# EAGLE design M206 (EAGLE 6.6.0)
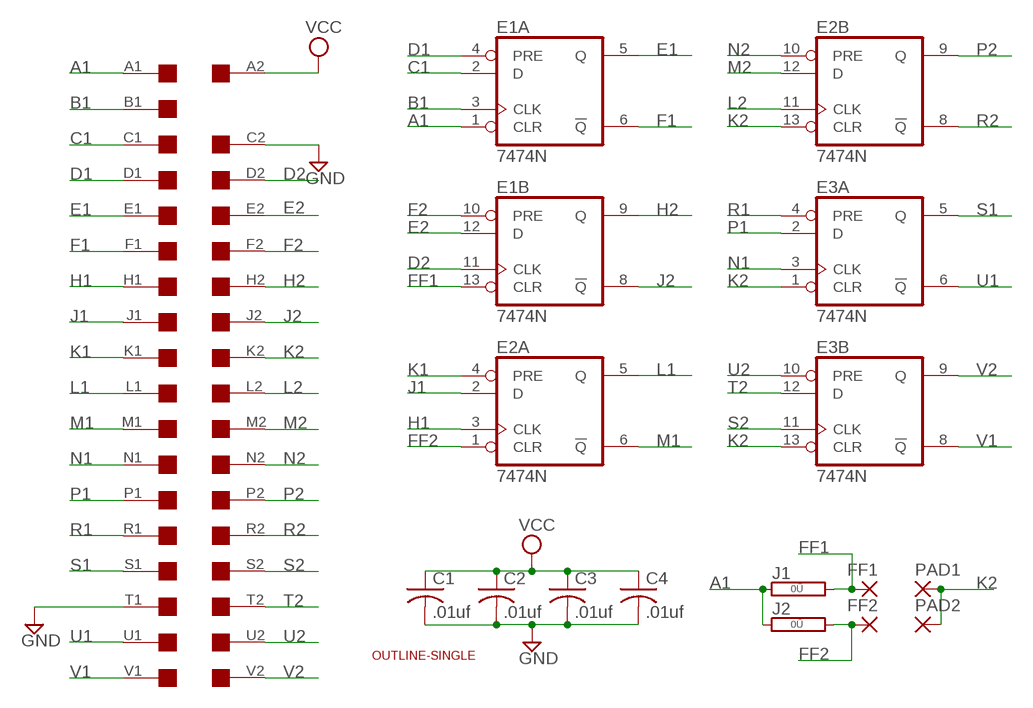
[diagram p0: schematic, sheet 1]

## Parts
C1  .01uf  C-US050-025X075  [C050-025X075]
C2  .01uf  C-US050-025X075  [C050-025X075]
C3  .01uf  C-US050-025X075  [C050-025X075]
C4  .01uf  C-US050-025X075  [C050-025X075]
E1  7474N  74S74N  [DIL14]
E2  7474N  74S74N  [DIL14]
E3  7474N  74S74N  [DIL14]
FF1  1,6/0,8  [1,6/0,8]
FF2  1,6/0,8  [1,6/0,8]
J1  0R  [0R/10]
J2  0R  [0R/10]
PAD1  1,6/0,8  [1,6/0,8]
PAD2  1,6/0,8  [1,6/0,8]
U$1  OUTLINE-SINGLE  [SINGLE]
U$4  SINGLE  [EDGE-CON2]

## Nets
A1: E1.1(A:CLR) J1.1 J2.1 U$4.A1
B1: E1.3(A:CLK) U$4.B1
C1: E1.2(A:D) U$4.C1
D1: E1.4(A:PRE) U$4.D1
D2: E1.11(B:CLK) U$4.D2
E1: E1.5(A:Q) U$4.E1
E2: E1.12(B:D) U$4.E2
F1: E1.6(A:!Q) U$4.F1
F2: E1.10(B:PRE) U$4.F2
FF1: E1.13(B:CLR) FF1.1(P) J1.2
FF2: E2.1(A:CLR) FF2.1(P) J2.2
GND: C1.2 C2.2 C3.2 C4.2 U$4.C2 U$4.T1
H1: E2.3(A:CLK) U$4.H1
H2: E1.9(B:Q) U$4.H2
J1: E2.2(A:D) U$4.J1
J2: E1.8(B:!Q) U$4.J2
K1: E2.4(A:PRE) U$4.K1
K2: E2.13(B:CLR) E3.1(A:CLR) E3.13(B:CLR) PAD1.1(P) PAD2.1(P) U$4.K2
L1: E2.5(A:Q) U$4.L1
L2: E2.11(B:CLK) U$4.L2
M1: E2.6(A:!Q) U$4.M1
M2: E2.12(B:D) U$4.M2
N1: E3.3(A:CLK) U$4.N1
N2: E2.10(B:PRE) U$4.N2
P1: E3.2(A:D) U$4.P1
P2: E2.9(B:Q) U$4.P2
R1: E3.4(A:PRE) U$4.R1
R2: E2.8(B:!Q) U$4.R2
S1: E3.5(A:Q) U$4.S1
S2: E3.11(B:CLK) U$4.S2
T2: E3.12(B:D) U$4.T2
U1: E3.6(A:!Q) U$4.U1
U2: E3.10(B:PRE) U$4.U2
V1: E3.8(B:!Q) U$4.V1
V2: E3.9(B:Q) U$4.V2
VCC: C1.1 C2.1 C3.1 C4.1 U$4.A2
Unconnected: U$4.B2

## Power pins joined to a net without a drawn wire
GND: E1.7(P:GND) E2.7(P:GND) E3.7(P:GND)
VCC: E1.14(P:VCC) E2.14(P:VCC) E3.14(P:VCC)

## Library data of the parts
C1-C4 = rcl:C-US: CAPACITOR, American symbol
E1-E3 = 74xx-us:74*74: Dual D type positive edge triggered FLIP FLOP, preset and clear
FF1 FF2 PAD1 PAD2 = wirepad:1,6/0,8: THROUGH-HOLE PAD
J1 J2 = jumper:0R: Bridge 0R 10mm
U$1 = dec-con:OUTLINE-*: Board outlines for DEC boards.
U$4 = dec-con:SINGLE: Single-Height DEC board

## Board
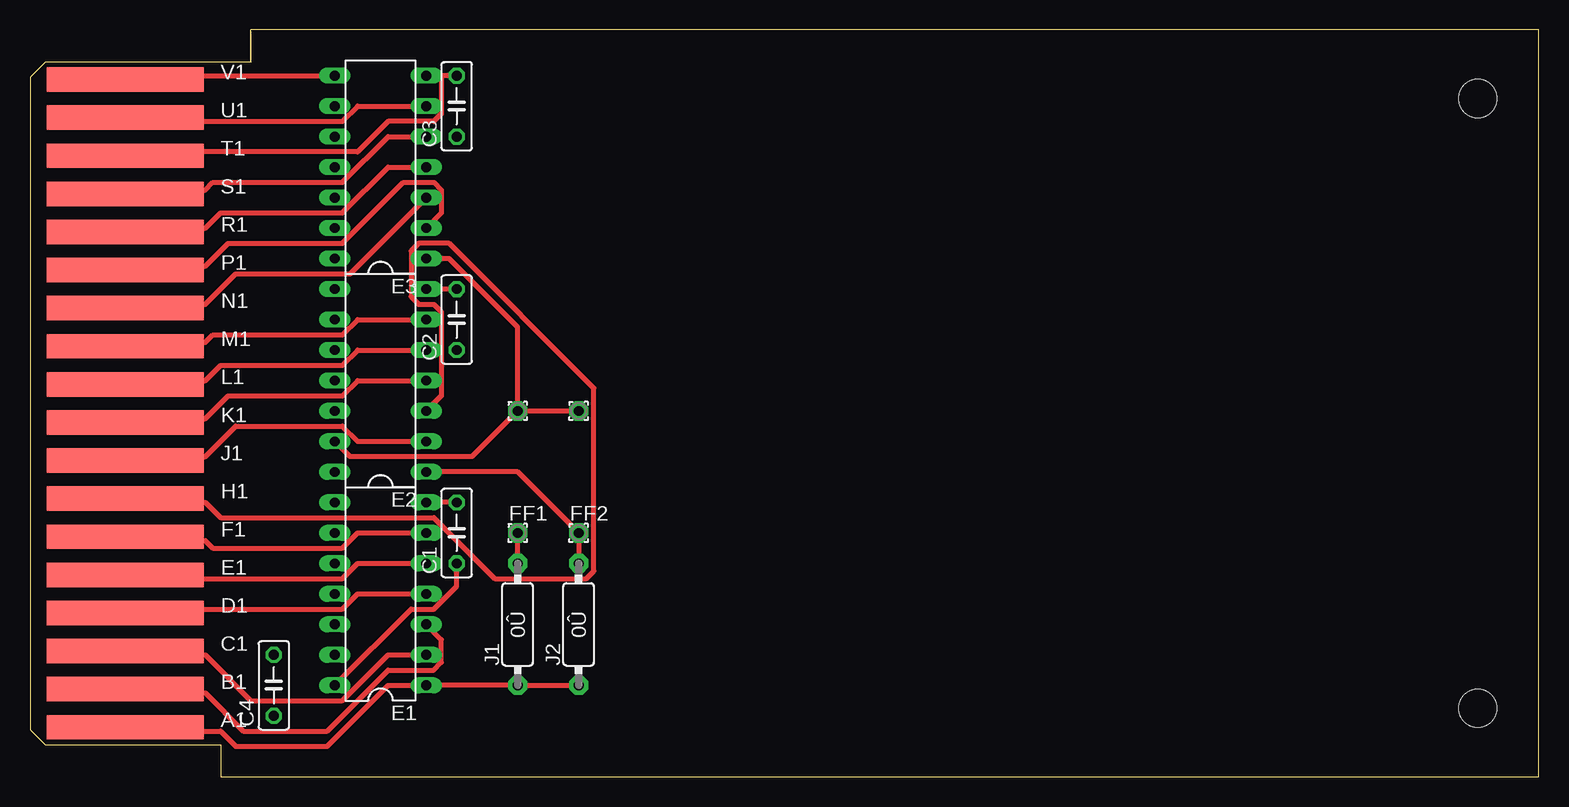
[diagram p1: board, top side]
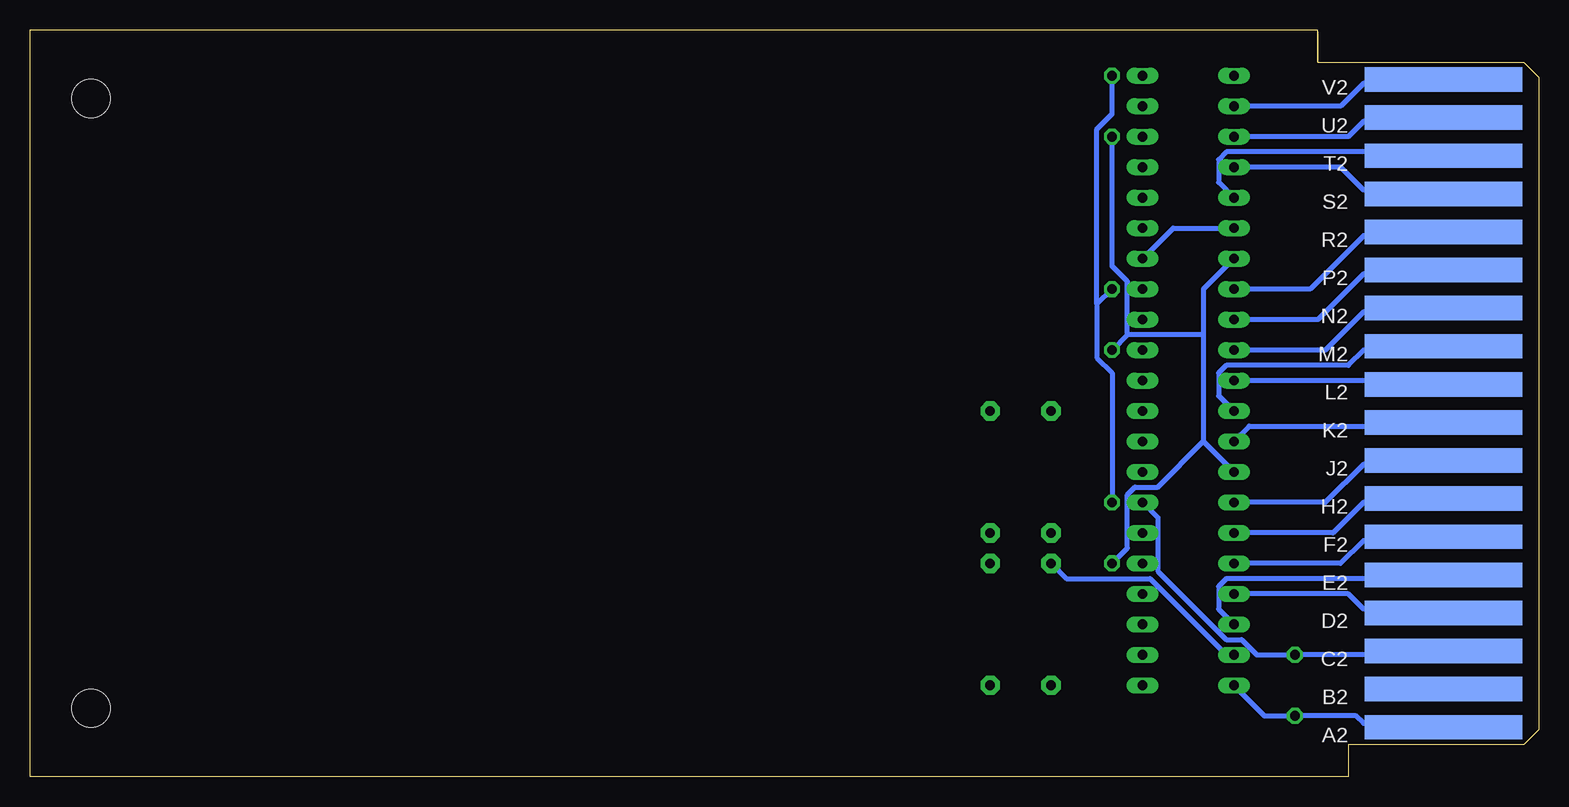
[diagram p2: board, bottom side, seen from below]

Size 125.73 x 62.23 mm. Coordinates in mm from the lower left corner, seen from the top.
Copper layers (1+16): Top 0.035mm / dielectric 1.5mm / Bottom 0.035mm
Design rules "16mils": minimum track width 16mil, minimum drill 32mil, track to track 15mil, track to pad 10mil, pad to pad 10mil, via to via 10mil, smd to smd 10mil, copper to edge 13mil, drill to drill 10mil, minimum pad ring 10mil, minimum via ring 8mil, stop-mask expansion 0mil, vias tented up to drill 0mil, thermal gap 10mil

### Footprints (pad centres in the part's own frame; a part is rotated, then mirrored left to right if it is on the bottom)
C050-025X075 = drill 0.813 octagon: 1 -2.54,0; 2 2.54,0
DIL14 = drill 0.813 long: 1 -7.62,-3.81; 2 -5.08,-3.81; 3 -2.54,-3.81; 4 0,-3.81; 5 2.54,-3.81; 6 5.08,-3.81; 7 7.62,-3.81; 8 7.62,3.81; 9 5.08,3.81; 10 2.54,3.81; 11 0,3.81; 12 -2.54,3.81; 13 -5.08,3.81; 14 -7.62,3.81
1,6/0,8 = drill 0.813 pad 1.6 octagon: 1 0,0
0R/10 = drill 0.813 pad 1.6 octagon: 1 -5.08,0; 2 5.08,0
SINGLE = hole 3.175: 120.65,56.515; 120.65,5.715
EDGE-CON2 = smd 13.106 x 2.032: A1 7.938,4.128; B1 7.938,7.303; C1 7.938,10.477; D1 7.938,13.652; E1 7.938,16.828; F1 7.938,20.003; H1 7.938,23.177; J1 7.938,26.352; K1 7.938,29.527; L1 7.938,32.703; M1 7.938,35.877; N1 7.938,39.053; P1 7.938,42.227; R1 7.938,45.403; S1 7.938,48.578; T1 7.938,51.752; U1 7.938,54.928; V1 7.938,58.102 | smd 13.106 x 2.032 bottom: A2 7.938,4.128; B2 7.938,7.303; C2 7.938,10.477; D2 7.938,13.652; E2 7.938,16.828; F2 7.938,20.003; H2 7.938,23.177; J2 7.938,26.352; K2 7.938,29.527; L2 7.938,32.703; M2 7.938,35.877; N2 7.938,39.053; P2 7.938,42.227; R2 7.938,45.403; S2 7.938,48.578; T2 7.938,51.752; U2 7.938,54.928; V2 7.938,58.102

### Placement (x,y rotation side)
C1  35.56,20.32 90 top
C2  35.56,38.1 90 top
C3  35.56,55.88 90 top
C4  20.32,7.62 90 top
E1  29.21,15.24 90 top
E2  29.21,33.02 90 top
E3  29.21,50.8 90 top
FF1  40.64,20.32 0 top
FF2  45.72,20.32 0 top
J1  40.64,12.7 90 top
J2  45.72,12.7 90 top
PAD1  40.64,30.48 0 top
PAD2  45.72,30.48 0 top
U$1  0,0 0 top
U$4  0,0 0 top

### Tracks (layer width: path | path; a pad name or v marks a point on that pad's centre or on a via)
A1
  Top 0.406: J2.1 J1.1 E1.1 29.85,7.62 24.77,2.54 17.15,2.54 15.88,3.81 8.26,3.81 U$4.A1
B1
  Top 0.406: E1.3 34.29,11.43 34.29,9.53 33.66,8.89 29.85,8.89 24.77,3.81 17.78,3.81 14.61,6.99 8.26,6.99 U$4.B1
C1
  Top 0.406: E1.2 29.85,10.16 26.04,6.35 18.42,6.35 14.61,10.16 8.26,10.16 U$4.C1
D1
  Top 0.406: E1.4 27.31,15.24 26.04,13.97 8.26,13.97 U$4.D1
D2
  Bottom 0.406: E1.11 15.88,15.24 14.61,13.97 8.26,13.97 U$4.D2
E1
  Top 0.406: E1.5 27.31,17.78 26.04,16.51 8.26,16.51 U$4.E1
E2
  Bottom 0.406: E1.12 26.67,13.97 26.67,15.88 26.04,16.51 8.26,16.51 U$4.E2
F1
  Top 0.406: E1.6 27.31,20.32 26.04,19.05 15.24,19.05 14.61,19.68 8.26,19.68 U$4.F1
F2
  Bottom 0.406: E1.10 16.51,17.78 14.61,19.68 8.26,19.68 U$4.F2
FF1
  Top 0.406: J1.2 FF1.1
  Bottom 0.406: E1.13 26.04,10.16 32.39,16.51 39.37,16.51 J1.2
FF2
  Top 0.406: E2.1 40.64,25.4 FF2.1 J2.2
GND
  Top 0.406: C3.2 34.29,58.42 | 34.29,58.42 E3.7 | C1.2 E1.7 | C2.2 E2.7 | 34.29,58.42 34.29,55.24 33.66,54.61 29.85,54.61 27.31,52.07 8.26,52.07 U$4.T1
  Bottom 0.406: U$4.C2 8.26,10.16 C4.2 23.5,10.16 24.77,11.43 26.04,11.43 31.75,17.14 31.75,21.59 E1.7 | C1.2 35.56,33.66 36.83,34.92 36.83,39.37 | C2.2 36.83,39.37 | C3.2 35.56,55.24 36.83,53.98 36.83,39.37
H1
  Top 0.406: E2.3 34.29,31.75 34.29,38.73 33.66,39.37 32.39,39.37 31.75,40.01 31.75,43.81 32.39,44.45 34.93,44.45 46.99,32.38 46.99,17.14 46.36,16.51 38.74,16.51 33.66,21.59 15.88,21.59 14.61,22.86 8.26,22.86 U$4.H1
H2
  Bottom 0.406: E1.9 17.15,20.32 14.61,22.86 8.26,22.86 U$4.H2
J1
  Top 0.406: E2.2 27.31,27.94 26.04,29.21 17.15,29.21 14.61,26.67 8.26,26.67 U$4.J1
J2
  Bottom 0.406: E1.8 17.78,22.86 14.61,26.04 8.26,26.04 U$4.J2
K1
  Top 0.406: E2.4 27.31,33.02 26.04,31.75 16.51,31.75 14.61,29.84 8.26,29.84 U$4.K1
K2
  Top 0.406: E2.13 26.67,26.67 36.83,26.67 PAD1.1 | PAD1.1 PAD2.1 | E3.1 34.93,43.18 40.64,37.47 PAD1.1
  Bottom 0.406: E3.13 30.48,45.72 E3.1 | E2.13 24.13,29.21 8.26,29.21 U$4.K2
L1
  Top 0.406: E2.5 27.31,35.56 26.04,34.29 15.88,34.29 14.61,33.02 8.26,33.02 U$4.L1
L2
  Bottom 0.406: E2.11 8.26,33.02 U$4.L2
M1
  Top 0.406: E2.6 27.31,38.1 26.04,36.83 15.24,36.83 14.61,36.2 8.26,36.2 U$4.M1
M2
  Bottom 0.406: E2.12 26.67,31.75 26.67,33.66 26.04,34.29 15.88,34.29 14.61,35.56 8.26,35.56 U$4.M2
N1
  Top 0.406: E3.3 26.67,41.91 17.15,41.91 14.61,39.37 8.26,39.37 U$4.N1
N2
  Bottom 0.406: E2.10 17.78,35.56 14.61,38.73 8.26,38.73 U$4.N2
P1
  Top 0.406: E3.2 34.29,46.99 34.29,48.9 33.66,49.53 31.12,49.53 26.04,44.45 16.51,44.45 14.61,42.55 8.26,42.55 U$4.P1
P2
  Bottom 0.406: E2.9 18.42,38.1 14.61,41.91 8.26,41.91 U$4.P2
R1
  Top 0.406: E3.4 29.85,50.8 26.04,46.99 15.88,46.99 14.61,45.72 8.26,45.72 U$4.R1
R2
  Bottom 0.406: E2.8 19.05,40.64 14.61,45.09 8.26,45.09 U$4.R2
S1
  Top 0.406: E3.5 29.85,53.34 26.04,49.53 15.24,49.53 14.61,48.9 8.26,48.9 U$4.S1
S2
  Bottom 0.406: E3.11 16.51,50.8 14.61,48.9 8.26,48.9 U$4.S2
T2
  Bottom 0.406: E3.12 26.67,49.53 26.67,51.44 26.04,52.07 8.26,52.07 U$4.T2
U1
  Top 0.406: E3.6 27.31,55.88 26.04,54.61 8.26,54.61 U$4.U1
U2
  Bottom 0.406: E3.10 15.88,53.34 14.61,54.61 8.26,54.61 U$4.U2
V1
  Top 0.406: E3.8 8.26,58.42 U$4.V1
V2
  Bottom 0.406: E3.9 16.51,55.88 14.61,57.78 8.26,57.78 U$4.V2
VCC
  Top 0.406: C1.1 35.56,15.88 33.66,13.97 31.75,13.97 E1.14
  Bottom 0.406: 27.94,27.94 E2.14 | 27.94,36.83 27.94,40.64 E3.14 | 27.94,36.83 27.94,27.94 | 34.29,36.83 C2.1 | 27.94,36.83 34.29,36.83 | C3.1 35.56,42.55 34.29,41.27 34.29,36.83 | E1.14 22.86,5.08 C4.1 15.24,5.08 14.61,4.45 8.26,4.45 U$4.A2 | 27.94,27.94 31.75,24.13 33.66,24.13 34.29,23.5 34.29,19.05 C1.1

### Text on the board
tValues: K2 | A1